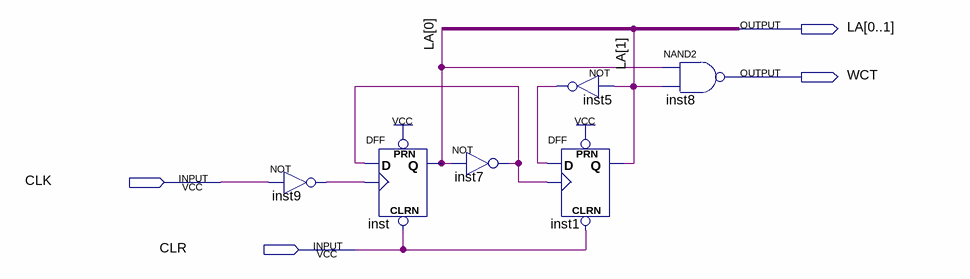
[diagram p0: schematic sheet]
// Quartus schematic Counter.bdf as structural Verilog: 6 symbols, 4 pins
module Counter (
  input  CLK,
  input  CLR,
  output [0:1] LA,
  output WCT
);

  wire inst5_out, inst7_out, inst9_out;

  not inst9 (inst9_out, CLK);
  DFF inst (.CLRN(CLR), .CLK(inst9_out), .D(inst7_out), .PRN(1'b1), .Q(LA[0]));
  not inst7 (inst7_out, LA[0]);
  not inst5 (inst5_out, LA[1]);
  DFF inst1 (.CLRN(CLR), .CLK(inst7_out), .D(inst5_out), .PRN(1'b1), .Q(LA[1]));
  nand inst8 (WCT, LA[0], LA[1]);
endmodule
